# EAGLE design eNode4 (EAGLE 7.2.0)
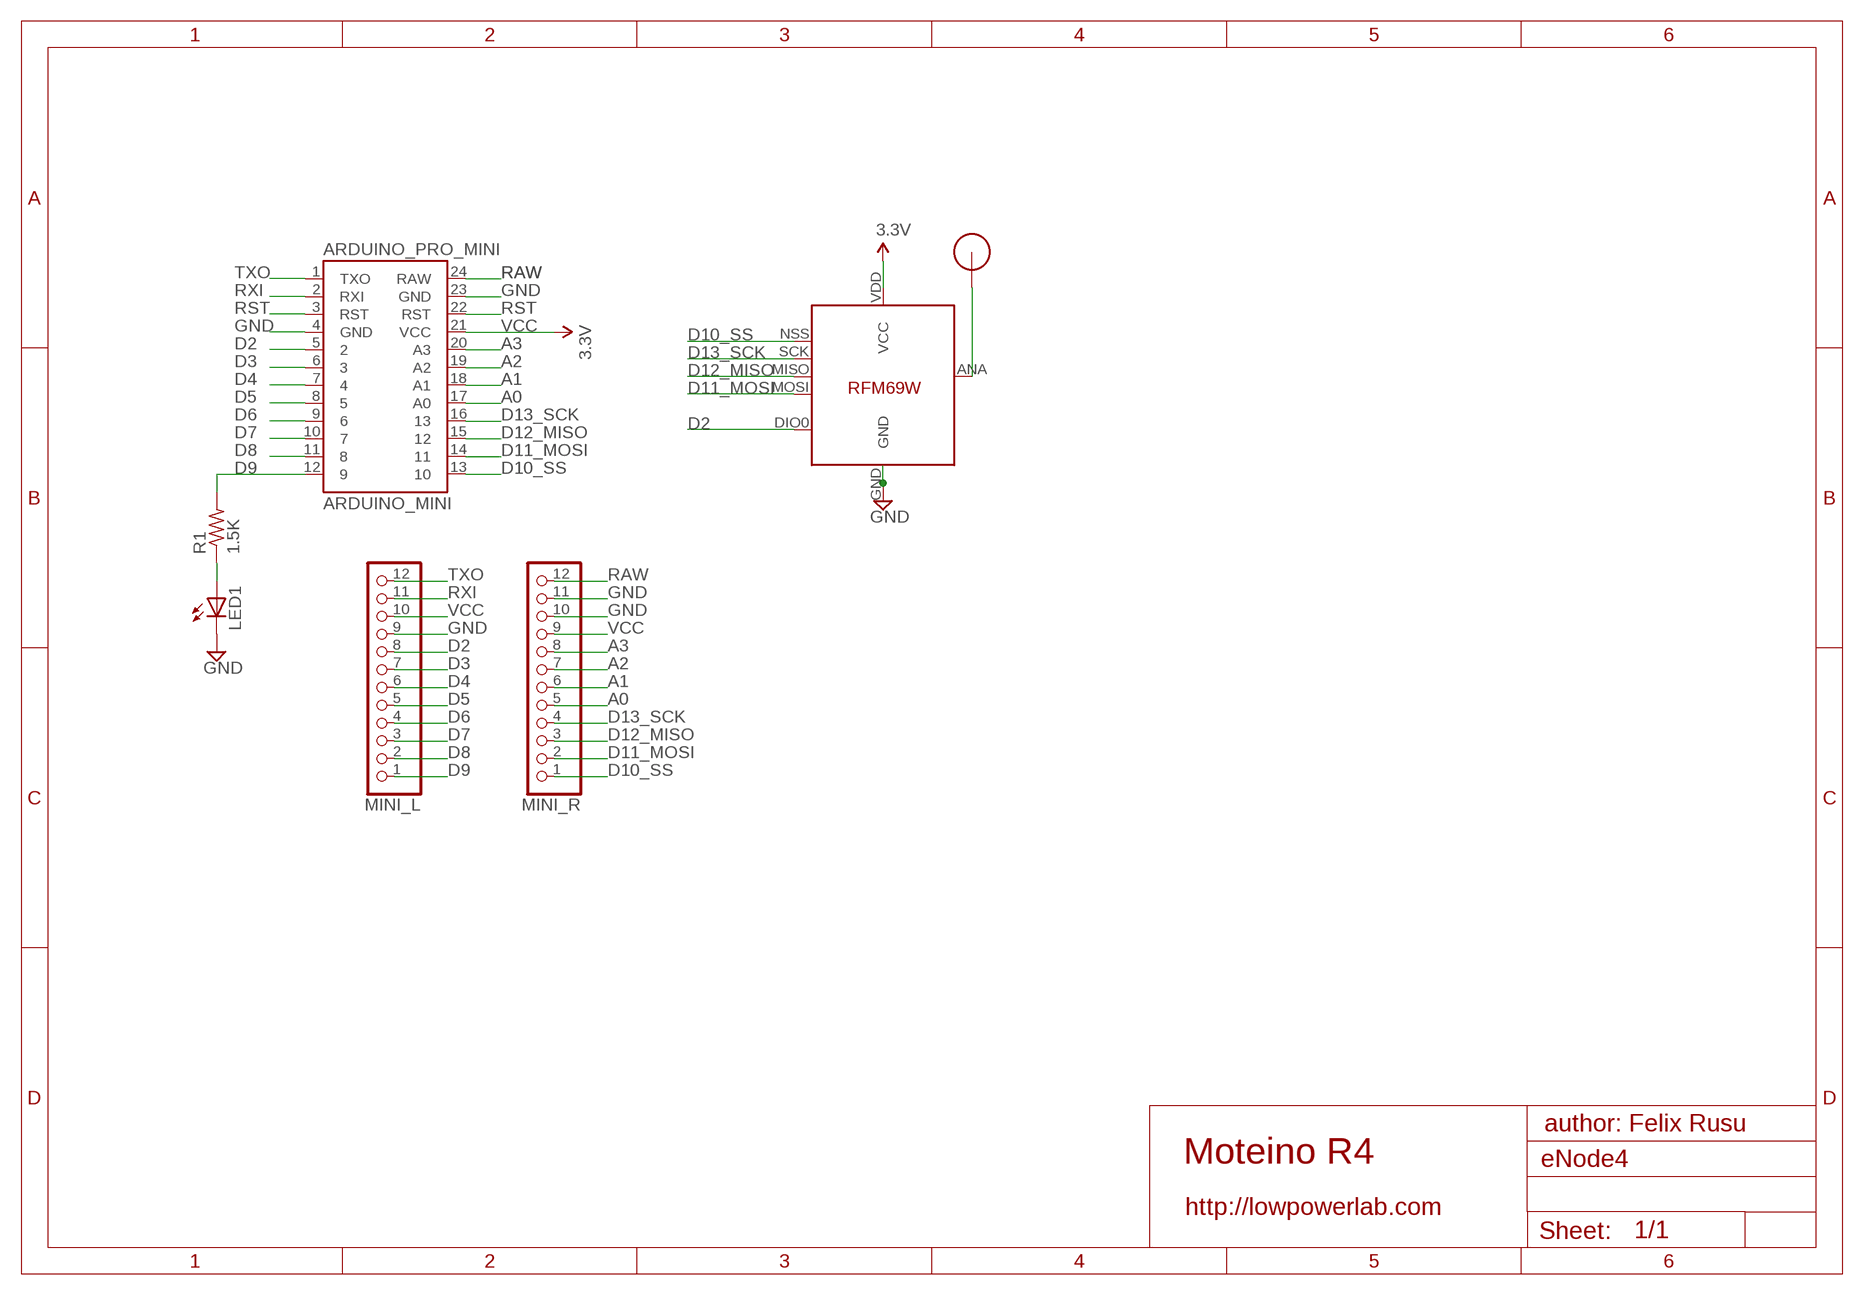
[diagram p0: schematic, sheet 1]

## Parts
ARDUINO_PRO_MINI  ARDUINO_MINI  [ARDUINO_MINI]
LED1  LED3MM  [LED3MM]
MINI_L  PINHD-1X12-CB  [1X12-CB]
MINI_R  PINHD-1X12-CB  [1X12-CB]
R1  1.5K  R-US_R0805  [R0805]
U$1  RFM12B_ANTENNA  [RFM12B-ANTENNA]
U$5  RFM69  [RFM69W-MINPADS]

## Nets
A0: ARDUINO_PRO_MINI.17(A0) MINI_R.5
A1: ARDUINO_PRO_MINI.18(A1) MINI_R.6
A2: ARDUINO_PRO_MINI.19(A2) MINI_R.7
A3: ARDUINO_PRO_MINI.20(A3) MINI_R.8
D2: ARDUINO_PRO_MINI.5 MINI_L.8 U$5.DIO0
D3: ARDUINO_PRO_MINI.6 MINI_L.7
D4: ARDUINO_PRO_MINI.7 MINI_L.6
D5: ARDUINO_PRO_MINI.8 MINI_L.5
D6: ARDUINO_PRO_MINI.9 MINI_L.4
D7: ARDUINO_PRO_MINI.10 MINI_L.3
D8: ARDUINO_PRO_MINI.11 MINI_L.2
D9: ARDUINO_PRO_MINI.12 MINI_L.1 R1.2
D10_SS: ARDUINO_PRO_MINI.13 MINI_R.1 U$5.NSS(SEL)
D11_MOSI: ARDUINO_PRO_MINI.14 MINI_R.2 U$5.MOSI
D12_MISO: ARDUINO_PRO_MINI.15 MINI_R.3 U$5.MISO
D13_SCK: ARDUINO_PRO_MINI.16 MINI_R.4 U$5.SCK
GND [power]: ARDUINO_PRO_MINI.4(GND) ARDUINO_PRO_MINI.23(GND) LED1.K(C) MINI_L.9 MINI_R.10 MINI_R.11 U$5.GND
N$1: LED1.A R1.1
N$3: U$1.P$1 U$5.ANA(ANT)
RAW: ARDUINO_PRO_MINI.24(RAW) MINI_R.12
RST: ARDUINO_PRO_MINI.3(RST) ARDUINO_PRO_MINI.22(RST)
RXI: ARDUINO_PRO_MINI.2(RXI) MINI_L.11
TXO: ARDUINO_PRO_MINI.1(TXO) MINI_L.12
VCC: ARDUINO_PRO_MINI.21(VCC) MINI_L.10 MINI_R.9 U$5.VDD(VCC) ; supply symbol labelled 3.3V

## Notes on the sheet
- author: Felix Rusu
- Moteino R4
- http://lowpowerlab.com

## Library data of the parts
ARDUINO_PRO_MINI = SparkFun-Boards:ARDUINO_MINI: Arduino Pro Mini footprint
LED1 = adafruit:LED: LED OSRAM: - CHIPLED LG R971, LG N971, LY N971, LG Q971, LY Q971, LO R971, LY R971 LH N974, LH R974 LS Q976, LO Q976, LY Q976 LO Q996 - Hyper CHIPLED LW Q18S LB Q993, LB Q99A, LB R99A - SideLED LS A670, LO A670, LY A670, LG A670, LP A670 LB A673, LV A673, LT A673, LW A673 LH A674 LY A675 LS A676, LA A676, LO A676, LY A676, LW A676 LS A679, LY A679, LG A679 - Hyper Micro SIDELED® LS Y876, LA Y876, LO Y876, LY Y876 LT Y87S - SmartLED LW L88C, LW L88S LB L89C, LB L89S, LG L890 LS L89K, LO L89K, LY L89K LS L896, LA L896, LO L896, LY L896 - TOPLED LS T670, LO T670, LY T670, LG T670, LP T670 LSG T670, LSP T670, LSY T670, LOP T670, LYG T670 LG T671, LOG T671, LSG T671 LB T673, LV T673, LT T673, LW T673 LH T674 LS T676, LA T676, LO T676, LY T676, LB T676, LH T676, LSB T676, LW T676 LB T67C, LV T67C, LT T67C, LS T67K, LO T67K, LY T67K, LW E67C LS E67B, LA E67B, LO E67B, LY E67B, LB E67C, LV E67C, LT E67C LW T67C LS T679, LY T679, LG T679 LS T770, LO T770, LY T770, LG T770, LP T770 LB T773, LV T773, LT T773, LW T773 LH T774 LS E675, LA E675, LY E675, LS T675 LS T776, LA T776, LO T776, LY T776, LB T776 LHGB T686 LT T68C, LB T68C - Hyper Mini TOPLED® LB M676 - Mini TOPLED Santana® LG M470 LS M47K, LO M47K, LY M47K Source: http://www.osram.convergy.de/
MINI_L MINI_R = adafruit:PINHD-1X12: PIN HEADER
R1 = adafruit:R-US_: RESISTOR, American symbol
U$1 = LowPowerLab:RFM12B_ANTENNA
U$5 = LowPowerLab:RFM69

## Net classes
1 power: width 0.381 mm, clearance 0.254 mm

## Board
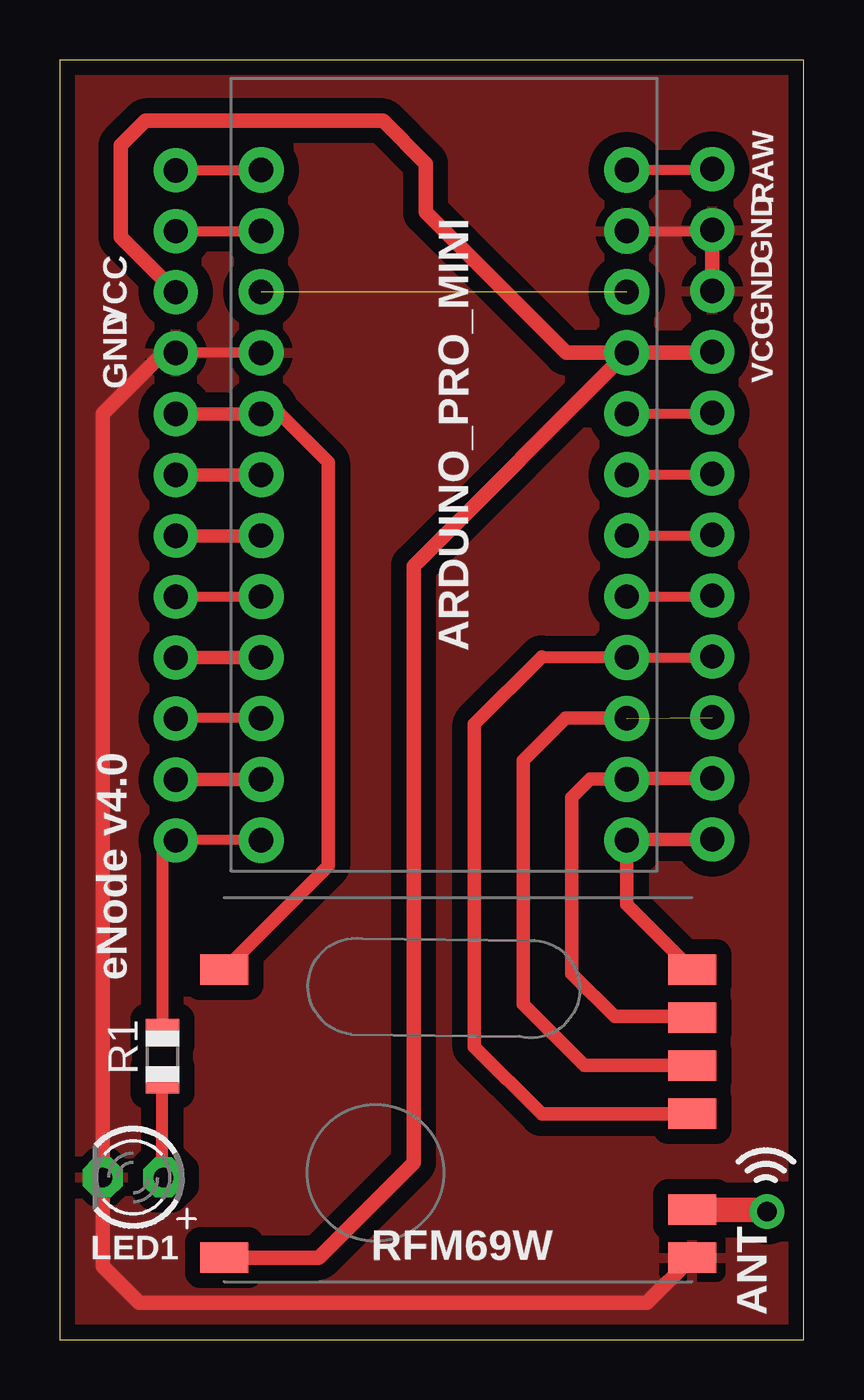
[diagram p1: board, top side]
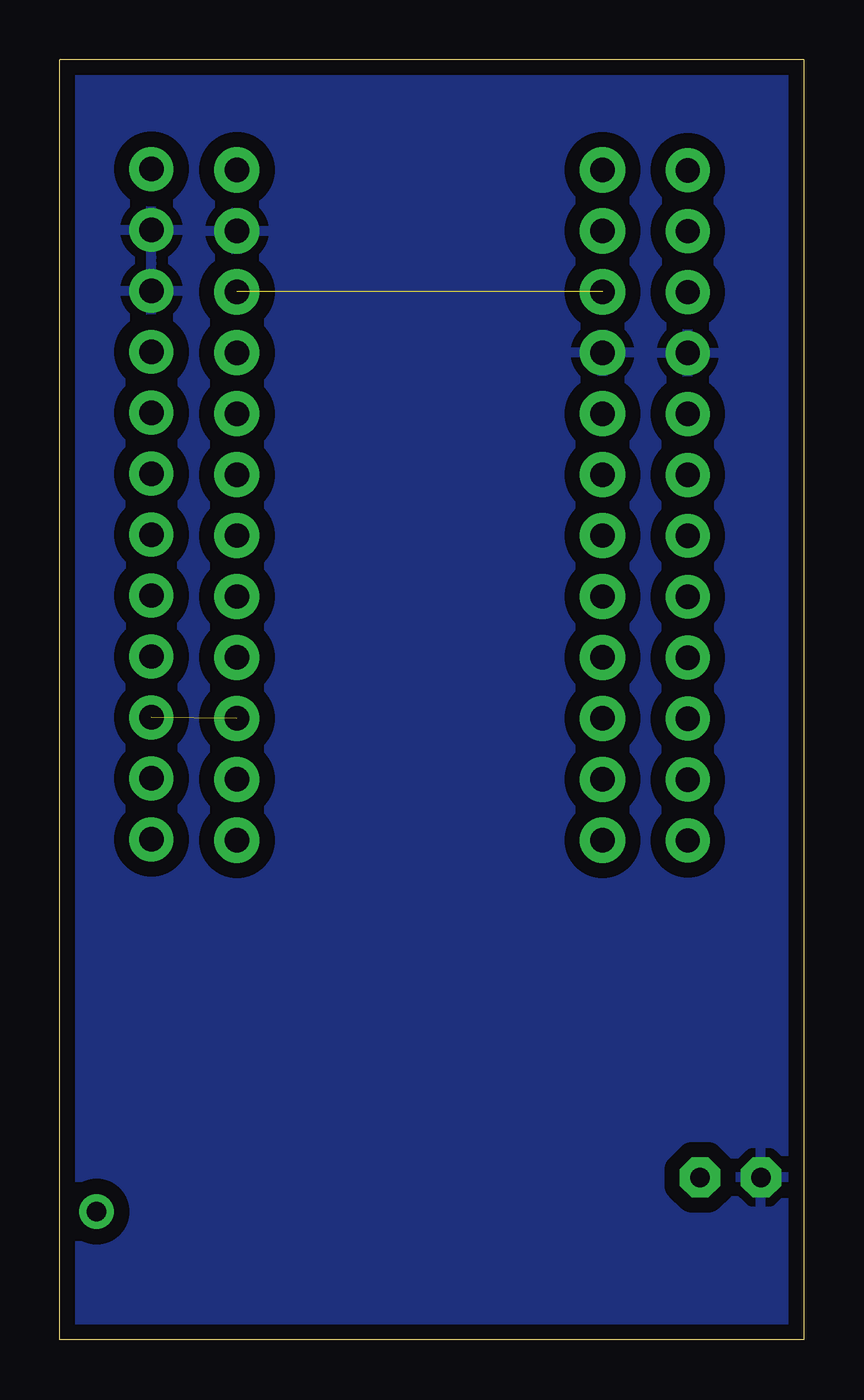
[diagram p2: board, bottom side, seen from below]

Size 30.99 x 53.34 mm. Coordinates in mm from the lower left corner, seen from the top.
Outline: 30.99,0 30.99,53.34 0,53.34 0,0 30.99,0
Copper layers (1*16): Top 0.035mm / dielectric 1.5mm / Bottom 0.035mm
Design rules "ITEADstudio_DRC *": minimum track width 20mil, minimum drill 20mil, track to track 25mil, track to pad 25mil, pad to pad 25mil, via to via 25mil, smd to smd 0mil, copper to edge 25mil, drill to drill 25mil, minimum pad ring 10mil, minimum via ring 6mil, stop-mask expansion 2mil, vias tented up to drill 100mil, thermal gap 15mil

### Footprints (pad centres in the part's own frame; a part is rotated, then mirrored left to right if it is on the bottom)
ARDUINO_MINI = drill 1.016 pad 1.88: 1 -7.62,12.7; 2 -7.62,10.16; 3 -7.62,7.62; 4 -7.62,5.08; 5 -7.62,2.54; 6 -7.62,0; 7 -7.62,-2.54; 8 -7.62,-5.08; 9 -7.62,-7.62; 10 -7.62,-10.16; 11 -7.62,-12.7; 12 -7.62,-15.24; 13 7.62,-15.24; 14 7.62,-12.7; 15 7.62,-10.16; 16 7.62,-7.62; 17 7.62,-5.08; 18 7.62,-2.54; 19 7.62,0; 20 7.62,2.54; 21 7.62,5.08; 22 7.62,7.62; 23 7.62,10.16; 24 7.62,12.7
LED3MM = drill 0.813 pad 1.676 octagon: A -1.27,0; K 1.27,0
1X12-CB = drill 1.016 pad 1.778: 1 -13.97,0; 2 -11.43,0; 3 -8.89,0; 4 -6.35,0; 5 -3.81,0; 6 -1.27,0; 7 1.27,0; 8 3.81,0; 9 6.35,0; 10 8.89,0; 11 11.43,0; 12 13.97,0
R0805 = smd 1.1 x 1.4: 1 -1,0; 2 1,0
RFM12B-ANTENNA = drill 0.8 pad 1.422: P$1 0,0
RFM69W-MINPADS = smd 2 x 1.27: ANA 8,-5; DIO0 -11.5,5; GND 8,-7; MISO 8,1; MOSI 8,3; NSS 8,5; SCK 8,-1; VDD -11.5,-7

### Placement (x,y rotation side)
ARDUINO_PRO_MINI  16,36.05 0 top
LED1  3.05,6.76 180 top
MINI_L  4.83,34.77 90 top
MINI_R  27.18,34.82 90 top
R1  4.27,11.81 90 top
U$1  29.46,5.33 0 top
U$5  18.34,10.41 0 top

### Tracks (layer width: path | path; a pad name or v marks a point on that pad's centre or on a via)
A0
  Top 0.406: ARDUINO_PRO_MINI.17 27.18,30.97 MINI_R.5
A1
  Top 0.406: ARDUINO_PRO_MINI.18 27.18,33.51 MINI_R.6
A2
  Top 0.406: ARDUINO_PRO_MINI.19 27.18,36.05 MINI_R.7
A3
  Top 0.406: ARDUINO_PRO_MINI.20 27.18,38.59 MINI_R.8
D2
  Top 0.406: 8.38,38.58 ARDUINO_PRO_MINI.5
  Top 0.559: MINI_L.8 8.38,38.58 9.17,38.58 11.18,36.58 11.18,19.75 U$5.DIO0
D3
  Top 0.406: 8.38,36.04 ARDUINO_PRO_MINI.6
  Top 0.559: MINI_L.7 8.38,36.04
D4
  Top 0.406: 8.38,33.5 ARDUINO_PRO_MINI.7
  Top 0.559: MINI_L.6 8.38,33.5
D5
  Top 0.406: MINI_L.5 8.38,30.96 ARDUINO_PRO_MINI.8
D6
  Top 0.406: 8.38,28.42 ARDUINO_PRO_MINI.9
  Top 0.559: MINI_L.4 8.38,28.42
D7
  Top 0.406: ARDUINO_PRO_MINI.10 4.83,25.91 MINI_L.3
  Top 0.508: 7.75,25.91 ARDUINO_PRO_MINI.10
D8
  Top 0.406: 8.38,23.34 ARDUINO_PRO_MINI.11
  Top 0.559: MINI_L.2 8.38,23.34
D9
  Top 0.406: 8.37,20.83 4.83,20.83 MINI_L.1 4.27,20.8
  Top 0.508: 4.27,20.8 R1.2
  Top 0.559: 8.37,20.83 ARDUINO_PRO_MINI.12
D10_SS
  Top 0.559: U$5.NSS 23.62,18.13 23.62,20.19 ARDUINO_PRO_MINI.13 23.66,20.85 MINI_R.1
D11_MOSI
  Top 0.406: 23.62,23.39 ARDUINO_PRO_MINI.14
  Top 0.508: 22.99,23.37 ARDUINO_PRO_MINI.14 | 26.29,13.46 U$5.MOSI
  Top 0.559: MINI_R.2 23.62,23.39 | 22.99,23.37 22.1,23.37 21.34,22.61 21.34,15.24 23.11,13.46 26.29,13.46
D12_MISO  (1 unrouted)
  Top 0.508: 22.99,25.91 ARDUINO_PRO_MINI.15 | 26.32,11.43 U$5.MISO
  Top 0.559: 22.99,25.91 21.08,25.91 19.3,24.13 19.3,13.97 21.84,11.43 26.32,11.43
D13_SCK
  Top 0.406: ARDUINO_PRO_MINI.16 27.18,28.43 MINI_R.4
  Top 0.508: 22.99,28.45 23.11,28.45 | 23.11,28.45 ARDUINO_PRO_MINI.16 | 20.07,28.45 23.11,28.45 | 26.32,9.4 U$5.SCK
  Top 0.559: 20.07,28.45 17.27,25.65 17.27,12.19 20.07,9.4 26.32,9.4
GND
  Top 0.406: ARDUINO_PRO_MINI.23 27.18,46.21 MINI_R.11 | ARDUINO_PRO_MINI.4 4.83,41.13 MINI_L.9 4.29,41.12
  Top 0.61: U$5.GND 24.45,1.52 3.3,1.52 1.78,3.05 LED1.K 1.78,38.61 4.29,41.12 | 27.18,46.21 MINI_R.10
  pour Bottom (isolate 0.61): -7.49,61.65 -7.49,-2.29 38.71,-2.57 38.71,61.37
  pour Top (isolate 0.61): -7.47,61.57 -7.49,-2.29 38.53,-2.57 38.56,61.29
N$1
  Top 0.406: LED1.A 4.27,6.76
  Top 0.508: 4.27,6.76 R1.1
N$3
  Top 0.61: 29.38,5.41 U$1.P$1
  Top 1.016: U$5.ANA 29.38,5.41
RAW
  Top 0.406: ARDUINO_PRO_MINI.24 27.18,48.77 MINI_R.12
  Top 0.508: ARDUINO_PRO_MINI.24
RST  (1 unrouted)
RXI
  Top 0.406: MINI_L.11 8.38,46.2 ARDUINO_PRO_MINI.2
TXO
  Top 0.406: ARDUINO_PRO_MINI.1 8.38,48.74 MINI_L.12
VCC
  Top 0.61: ARDUINO_PRO_MINI.21 14.73,32.25 14.73,7.37 10.78,3.41 U$5.VDD | ARDUINO_PRO_MINI.21 21.1,41.13 15.24,46.99 15.24,49.02 13.46,50.8 3.56,50.8 2.54,49.78 2.54,45.95 MINI_L.10 | ARDUINO_PRO_MINI.21 27.14,41.13 MINI_R.9

### Text on the board
tNames: RAW | GND | VCC | GND | GND | VCC | eNode v4.0 | RFM69W | ANT